# EAGLE design SmoothieDriverDualDC (EAGLE 6.2)
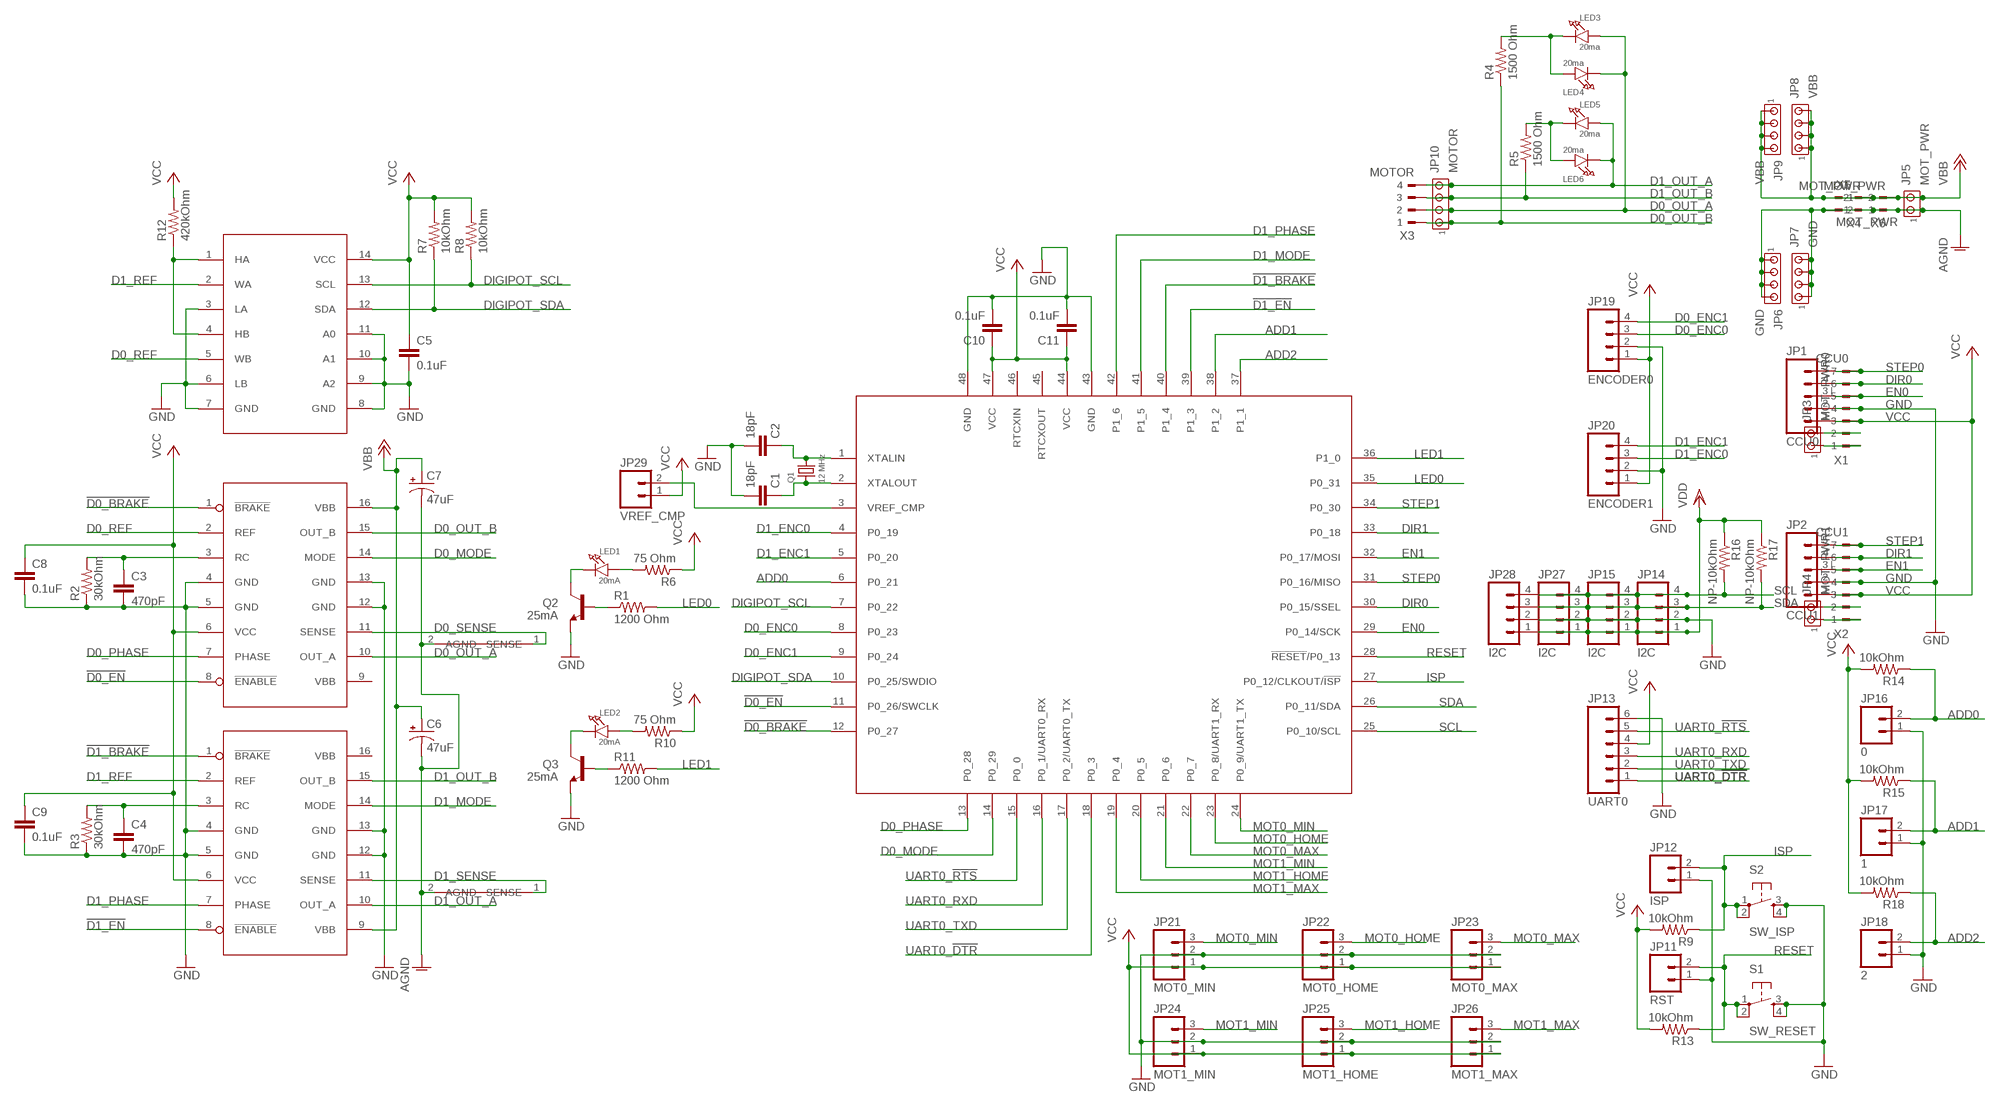
[diagram p0: schematic, sheet 1]

## Parts
C1  18pF  C-EUC0603  [C0603]
C2  18pF  C-EUC0603  [C0603]
C3  470pF  C-EUC0603  [C0603]
C4  470pF  C-EUC0603  [C0603]
C5  0.1uF  C-EUC0603  [C0603]
C6  47uF  CAP_POLD  [PANASONIC_D]
C7  47uF  CAP_POLD  [PANASONIC_D]
C8  0.1uF  C-EUC0603  [C0603]
C9  0.1uF  C-EUC0603  [C0603]
C10  0.1uF  C-EUC0603  [C0603]
C11  0.1uF  C-EUC0603  [C0603]
JP1  CCU0  M05PTH  [1X05]
JP2  CCU1  M05PTH  [1X05]
JP3  MOT_PWR0  MTA02-100  [10X02MTA]
JP4  MOT_PWR1  MTA02-100  [10X02MTA]
JP5  MOT_PWR  MTA02-100  [10X02MTA]
JP6  GND  MTA04-100  [10X04MTA]
JP7  GND  MTA04-100  [10X04MTA]
JP8  VBB  MTA04-100  [10X04MTA]
JP9  VBB  MTA04-100  [10X04MTA]
JP10  MOTOR  MTA04-100  [10X04MTA]
JP11  RST  M02PTH  [1X02]
JP12  ISP  M02PTH  [1X02]
JP13  UART0  M06SIP  [1X06]
JP14  I2C  M04PTH  [1X04]
JP15  I2C  M04PTH  [1X04]
JP16  0  M02PTH  [1X02]
JP17  1  M02PTH  [1X02]
JP18  2  M02PTH  [1X02]
JP19  ENCODER0  M04PTH  [1X04]
JP20  ENCODER1  M04PTH  [1X04]
JP21  MOT0_MIN  M03PTH  [1X03]
JP22  MOT0_HOME  M03PTH  [1X03]
JP23  MOT0_MAX  M03PTH  [1X03]
JP24  MOT1_MIN  M03PTH  [1X03]
JP25  MOT1_HOME  M03PTH  [1X03]
JP26  MOT1_MAX  M03PTH  [1X03]
JP27  I2C  M04PTH  [1X04]
JP28  I2C  M04PTH  [1X04]
JP29  VREF_CMP  M02PTH  [1X02]
LED1  20mA  LED0805  [CHIPLED_0805]
LED2  20mA  LED0805  [CHIPLED_0805]
LED3  20ma  LED0805  [CHIPLED_0805]
LED4  20ma  LED0805  [CHIPLED_0805]
LED5  20ma  LED0805  [CHIPLED_0805]
LED6  20ma  LED0805  [CHIPLED_0805]
MCU1  LPC1227  [LQFP48]
Q1  12 MHz  CRYSTALTHIN  [CRYSTAL_3.2X2.5]
Q2  25mA  TRANSISTOR_NPNSOT23  [SOT23]
Q3  25mA  TRANSISTOR_NPNSOT23  [SOT23]
R1  1200 Ohm  R-US_R0603  [R0603]
R2  30kOhm  R-US_R0603  [R0603]
R3  30kOhm  R-US_R0603  [R0603]
R4  1500 Ohm  R-US_R0603  [R0603]
R5  1500 Ohm  R-US_R0603  [R0603]
R6  75 Ohm  R-US_R0603  [R0603]
R7  10kOhm  R-US_R0603  [R0603]
R8  10kOhm  R-US_R0603  [R0603]
R9  10kOhm  R-US_R0603  [R0603]
R10  75 Ohm  R-US_R0603  [R0603]
R11  1200 Ohm  R-US_R0603  [R0603]
R12  420kOhm  R-US_R0603  [R0603]
R13  10kOhm  R-US_R0603  [R0603]
R14  10kOhm  R-US_R0603  [R0603]
R15  10kOhm  R-US_R0603  [R0603]
R16  NP-10kOhm  R-US_R0603  [R0603]
R17  NP-10kOhm  R-US_R0603  [R0603]
R18  10kOhm  R-US_R0603  [R0603]
S1  SW_RESET  TAC_SWITCHSMD  [TACTILE_SWITCH_SMD]
S2  SW_ISP  TAC_SWITCHSMD  [TACTILE_SWITCH_SMD]
U1  MAX5387-50kOhm  MAX5387  [TSSOP14]
U2  A4973  [SO16L]
U3  A4973  [SO16L]
U$1  CONNECTOR  [CONNECT]
U$2  CONNECTOR  [CONNECT]
X1  CCU0  180G-7  [180G-7]
X2  CCU1  180G-7  [180G-7]
X3  MOTOR  180G-4  [180G-4]
X4  MOT_PWR  180G-2  [180G-2]
X5  MOT_PWR  180G-2  [180G-2]
X6  MOT_PWR  180G-2  [180G-2]

## Nets
!D0_BRAKE: MCU1.12(P0_27) U2.1(!BRAKE)
!D0_EN: MCU1.11(P0_26/SWCLK) U2.8(!ENABLE)
!D1_BRAKE: MCU1.40(P1_4) U3.1(!BRAKE)
!D1_EN: MCU1.39(P1_3) U3.8(!ENABLE)
ADD0: JP16.2 MCU1.6(P0_21) R14.1
ADD1: JP17.2 MCU1.38(P1_2) R15.1
ADD2: JP18.2 MCU1.37(P1_1) R18.1
AGND: C6.- C7.- JP5.1 JP6.1 JP6.2 JP6.3 JP6.4 JP7.1 JP7.2 JP7.3 JP7.4 U$1.2(AGND) U$2.2(AGND) X4.1 X5.2 X6.1
D0_ENC0: JP19.3 MCU1.8(P0_23)
D0_ENC1: JP19.4 MCU1.9(P0_24)
D0_MODE: MCU1.14(P0_29) U2.14(MODE)
D0_OUT_A: JP10.2 LED3.A LED4.C U2.10(OUT_A) X3.2
D0_OUT_B: JP10.1 R4.1 U2.15(OUT_B) X3.1
D0_PHASE: MCU1.13(P0_28) U2.7(PHASE)
D0_REF: U1.5(WB) U2.2(REF)
D0_SENSE: U2.11(SENSE) U$2.1(SENSE)
D1_ENC0: JP20.3 MCU1.4(P0_19)
D1_ENC1: JP20.4 MCU1.5(P0_20)
D1_MODE: MCU1.41(P1_5) U3.14(MODE)
D1_OUT_A: JP10.4 LED5.A LED6.C U3.10(OUT_A) X3.4
D1_OUT_B: JP10.3 R5.1 U3.15(OUT_B) X3.3
D1_PHASE: MCU1.42(P1_6) U3.7(PHASE)
D1_REF: U1.2(WA) U3.2(REF)
D1_SENSE: U3.11(SENSE) U$1.1(SENSE)
DIGIPOT_SCL: MCU1.7(P0_22) R8.1 U1.13(SCL)
DIGIPOT_SDA: MCU1.10(P0_25/SWDIO) R7.1 U1.12(SDA)
DIR0: JP1.4 MCU1.30(P0_15/SSEL) X1.6
DIR1: JP2.4 MCU1.33(P0_18) X2.6
EN0: JP1.3 MCU1.29(P0_14/SCK) X1.5
EN1: JP2.3 MCU1.32(P0_17/MOSI) X2.5
GND: C1.2 C2.2 C3.2 C4.2 C5.2 C8.2 C9.2 C10.2 C11.2 JP1.2 JP2.2 JP11.1 JP12.1 JP13.6 JP14.2 JP15.2 JP16.1 JP17.1 JP18.1 JP19.2 JP20.2 JP21.2 JP22.2 JP23.2 JP24.2 JP25.2 JP26.2 JP27.2 JP28.2 MCU1.43(GND) MCU1.48(GND) Q2.2(E) Q3.2(E) R2.1 R3.1 S1.3 S1.4 S2.3 S2.4 U1.3(LA) U1.6(LB) U1.7(GND) U1.8(GND) U1.9(A2) U1.10(A1) U1.11(A0) U2.4(GND) U2.5(GND) U2.12(GND) U2.13(GND) U3.4(GND) U3.5(GND) U3.12(GND) U3.13(GND) X1.4 X2.4
ISP: JP12.2 MCU1.27(P0_12/CLKOUT/!ISP) R9.1 S2.1 S2.2
LED0: MCU1.35(P0_31) R1.2
LED1: MCU1.36(P1_0) R11.2
MOT0_HOME: JP22.3 MCU1.23(P0_8/UART1_RX)
MOT0_MAX: JP23.3 MCU1.22(P0_7)
MOT0_MIN: JP21.3 MCU1.24(P0_9/UART1_TX)
MOT1_HOME: JP25.3 MCU1.20(P0_5)
MOT1_MAX: JP26.3 MCU1.19(P0_4)
MOT1_MIN: JP24.3 MCU1.21(P0_6)
N$1: LED1.A R6.2
N$2: LED1.C Q2.3(C)
N$3: C3.1 R2.2 U2.3(RC)
N$4: C2.1 MCU1.1(XTALIN) Q1.2
N$5: C1.1 MCU1.2(XTALOUT) Q1.1
N$6: Q2.1(B) R1.1
N$7: Q3.1(B) R11.1
N$8: C4.1 R3.2 U3.3(RC)
N$9: LED2.A R10.2
N$10: LED2.C Q3.3(C)
N$11: R12.1 U1.1(HA) U1.4(HB)
N$12: LED5.C LED6.A R5.2
N$13: LED3.C LED4.A R4.2
N$14: JP4.2 X2.2
N$15: JP4.1 X2.1
N$16: JP3.2 X1.2
N$17: JP3.1 X1.1
N$18: JP29.2 MCU1.3(VREF_CMP)
RESET: JP11.2 MCU1.28(!RESET!/P0_13) R13.1 S1.1 S1.2
SCL: JP14.4 JP15.4 JP27.4 JP28.4 MCU1.25(P0_10/SCL) R16.2
SDA: JP14.3 JP15.3 JP27.3 JP28.3 MCU1.26(P0_11/SDA) R17.2
STEP0: JP1.5 MCU1.31(P0_16/MISO) X1.7
STEP1: JP2.5 MCU1.34(P0_30) X2.7
UART0_!DTR!: JP13.1 MCU1.18(P0_3)
UART0_!RTS!: JP13.5 MCU1.15(P0_0)
UART0_RXD: JP13.3 MCU1.16(P0_1/UART0_RX)
UART0_TXD: JP13.2 MCU1.17(P0_2/UART0_TX)
VBB: C6.+ C7.+ JP5.2 JP8.1 JP8.2 JP8.3 JP8.4 JP9.1 JP9.2 JP9.3 JP9.4 U2.16(VBB) U3.9(VBB) X4.2 X5.1 X6.2
VCC: C5.1 C8.1 C9.1 C10.1 C11.1 JP1.1 JP2.1 JP13.4 JP19.1 JP20.1 JP21.1 JP22.1 JP23.1 JP24.1 JP25.1 JP26.1 JP29.1 MCU1.44(VCC) MCU1.47(VCC) R6.1 R7.2 R8.2 R9.2 R10.1 R12.2 R13.2 R14.2 R15.2 R18.2 U1.14(VCC) U2.6(VCC) U3.6(VCC) X1.3 X2.3
VDD: JP14.1 JP15.1 JP27.1 JP28.1 R16.1 R17.1
Unconnected: MCU1.45(RTCXOUT) MCU1.46(RTCXIN) U2.9(VBB) U3.16(VBB)

## Library data of the parts
C1-C5 C8-C11 = rcl:C-EU: CAPACITOR, European symbol
C6 C7 = SparkFun:CAP_POL: Capacitor Polarized These are standard SMD and PTH capacitors. Normally 10uF, 47uF, and 100uF in electrolytic and tantalum varieties. Always verify the external diameter of the through hole cap, it varies with capacity, voltage, and manufacturer. The EIA devices should be standard.
JP1 JP2 = SparkFun:M05: Header 5 Standard 5-pin 0.1" header. Use with straight break away headers (SKU : PRT-00116), right angle break away headers (PRT-00553), swiss pins (PRT-00743), machine pins (PRT-00117), and female headers (PRT-00115). Molex polarized connector foot print use with SKU : PRT-08230 with associated crimp pins and housings.
JP3-JP5 = con-amp:MTA02-100: AMP connector
JP6-JP10 = con-amp:MTA04-100: AMP connector
JP11 JP12 JP16-JP18 JP29 = SparkFun:M02: Header 2 Standard 2-pin 0.1" header. Use with straight break away headers (SKU : PRT-00116), right angle break away headers (PRT-00553), swiss pins (PRT-00743), machine pins (PRT-00117), and female headers (PRT-00115). Molex polarized connector foot print use with SKU : PRT-08233 with associated crimp pins and housings.
JP13 = SparkFun:M06: Header 6 Standard 6-pin 0.1" header. Use with straight break away headers (SKU : PRT-00116), right angle break away headers (PRT-00553), swiss pins (PRT-00743), machine pins (PRT-00117), and female headers (PRT-00115). Molex polarized connector foot print use with SKU : PRT-08094 with associated crimp pins and housings. NOTES ON THE VARIANTS LOCK and LOCK_LONGPADS... This footprint was designed to help hold the alignment of a through-hole component (i.e. 6-pin header) while soldering it into place. You may notice that each hole has been shifted either up or down by 0.005 of an inch from it's more standard position (which is a perfectly straight line). This slight alteration caused the pins (the squares in the middle) to touch the edges of the holes. Because they are alternating, it causes a "brace" to hold the component in place. 0.005 has proven to be the perfect amount of "off-center" position when using our standard breakaway headers. Although looks a little odd when you look at the bare footprint, once you have a header in there, the alteration is very hard to notice. Also, if you push a header all the way into place, it is covered up entirely on the bottom side. This idea of altering the position of holes to aid alignment will be further integrated into the Sparkfun Library for other footprints. It can help hold any component with 3 or more connection pins.
JP14 JP15 JP19 JP20 JP27 JP28 = SparkFun:M04: Header 4 Standard 4-pin 0.1" header. Use with straight break away headers (SKU : PRT-00116), right angle break away headers (PRT-00553), swiss pins (PRT-00743), machine pins (PRT-00117), and female headers (PRT-00115). Molex polarized connector foot print use with SKU : PRT-08231 with associated crimp pins and housings. 1MM SMD Version SKU: PRT-10208
JP21-JP26 = SparkFun:M03: Header 3 Standard 3-pin 0.1" header. Use with straight break away headers (SKU : PRT-00116), right angle break away headers (PRT-00553), swiss pins (PRT-00743), machine pins (PRT-00117), and female headers (PRT-00115). Molex polarized connector foot print use with SKU : PRT-08232 with associated crimp pins and housings.
LED1-LED6 = microbuilder:LED: LED 0603 - 0603 Surface Mount Package 2mA: Green LED - Low Power (3.9mcd, 2ma, 1.7Vf) - Digikey: 475-2709-2-ND Orange LED - Low Power (9.8mcd, 2ma, 1.8Vf) - Digikey: 475-1194-2-ND Red LED - Low Power (5mcd, 2ma, 1.8Vf) - Digikey: 475-1195-2-ND Yellow LED - Low Power (7mcd, 2ma, 1.8Vf) - Digikey: 475-1196-2-ND 5mA: Blue LED - Low Power (17mcd, 5ma, 2.9Vf) - Digikey: LNJ937W8CRACT-ND 0805 - 0805 Surface Mount Package 2mA: Red LED (8.8mcd, 2mA, 1.8Vf, Clear) - Low Power [Digikey: 475-2510-1-ND] Green LED (5mcd, 2mA, 1.8Vf, Clear) - Low Power [Digikey: 475-2730-1-ND] Yellow LED (11.3mcd, 2mA, 1.8Vf, Clear) - Low Power [Digikey: 475-2555-1-ND] 20mA: Red LED (104mcd, 20mA, Diffused) - LS R976 [Digikey: 475-1278-6-ND] Red LED (12mcd, 20mA, 2.0Vf, Clear) - APT2012EC [Digikey: 754-1128-1-ND] Green LED (15mcd, 20mA, 2.2Vf, Clear) - APT2012GC [Digikey: 754-1131-1-ND] Orange LED (160mcd, 20mA, 2.1Vf, Clear) - APT2012SECK [Digikey: 754-1130-1-ND] 1206 - 1206 Surface Mount Package Green LED (26mcd, 20mA, Diffused) - LG N971 [Digikey: 475-1407-6-ND] Red LED (15mcd, 20mA, Diffused) - LH N974 [Digikey: 475-1416-6-ND]
MCU1 = logxen:LPC1227
Q1 = microbuilder:CRYSTAL: Crystals HC49UP - Surface Mount Crystal 4.0MHz 18pF +/-30ppm Surface Mount Crystal [Digikey: 535-9857-1-ND] 12.0 MHz Surface Mount Crystal [Digikey: 535-9869-6-ND] 25.0 MHz Surface Mount Crystal [Digikey: 535-9078-1-ND] 3.2 x 2.5mm - MEMs SMT Crystal 12.0 MHz 8pF 15ppm 3.2 x 2.5mm Crystal [Digikey: -10-70°C: 644-1047-1-ND -40-125°C: 644-1128-1-ND] 16.0 MHz 8pF 15ppm 3.2 x 2.5mm Crystal [Digikey: -10-70°C: 644-1049-1-ND -40-125°C: 644-1129-2-ND] 16.0 MHz 10pF 10ppm 3.2 x 2.5mm Crystal [Digikey: 644-1100-1-ND] 27.12 MHz 18pF 30ppm 3.2 x 2.5mm Crystal [Digikey: 887-1424-1-ND] 27.12MHz 10pF 10ppm 3.2 x 2.5mm Crystal [Digikey: 887-1329-1-ND] 4.9 x 1.8mm - MEMs SMT Crystal 32.768 KHz 12.5pF 20ppm 4.9 x 1.8mm Crystal [Digikey: SE2415CT-ND] Cylinder 32.768KHz Cylinder Crystal
Q2 Q3 = SparkFun:TRANSISTOR_NPN: Transistor NPN BJT configuration in SOT23 package. MMBT2222 is the common NPN we use. Double check BCE configuration again layout.
R1-R18 = rcl:R-US_: RESISTOR, American symbol
S1 S2 = SparkFun:TAC_SWITCH: Momentary Switch Button commonly used for reset or general input. Spark Fun Electronics SKU : COM-00097
U1 = logxen:MAX5387: Dual, 256-Tap, Volatile, Low-Voltage Linear Taper Digital Potentiometer
U2 U3 = logxen:A4973: Full-bridge PWM Motor Driver
U$1 U$2 = logxen:CONNECTOR
X1 X2 = con-weidmueller-sl35:180G-7: WEIDMUELLER CLAMP CONNECTOR; OC_FARNELL: unknown; OC_NEWARK: unknown
X3 = con-weidmueller-sl35:180G-4: WEIDMUELLER CLAMP CONNECTOR; OC_FARNELL: unknown; OC_NEWARK: unknown
X4-X6 = con-weidmueller-sl35:180G-2: WEIDMUELLER CLAMP CONNECTOR; OC_FARNELL: unknown; OC_NEWARK: unknown

## Board
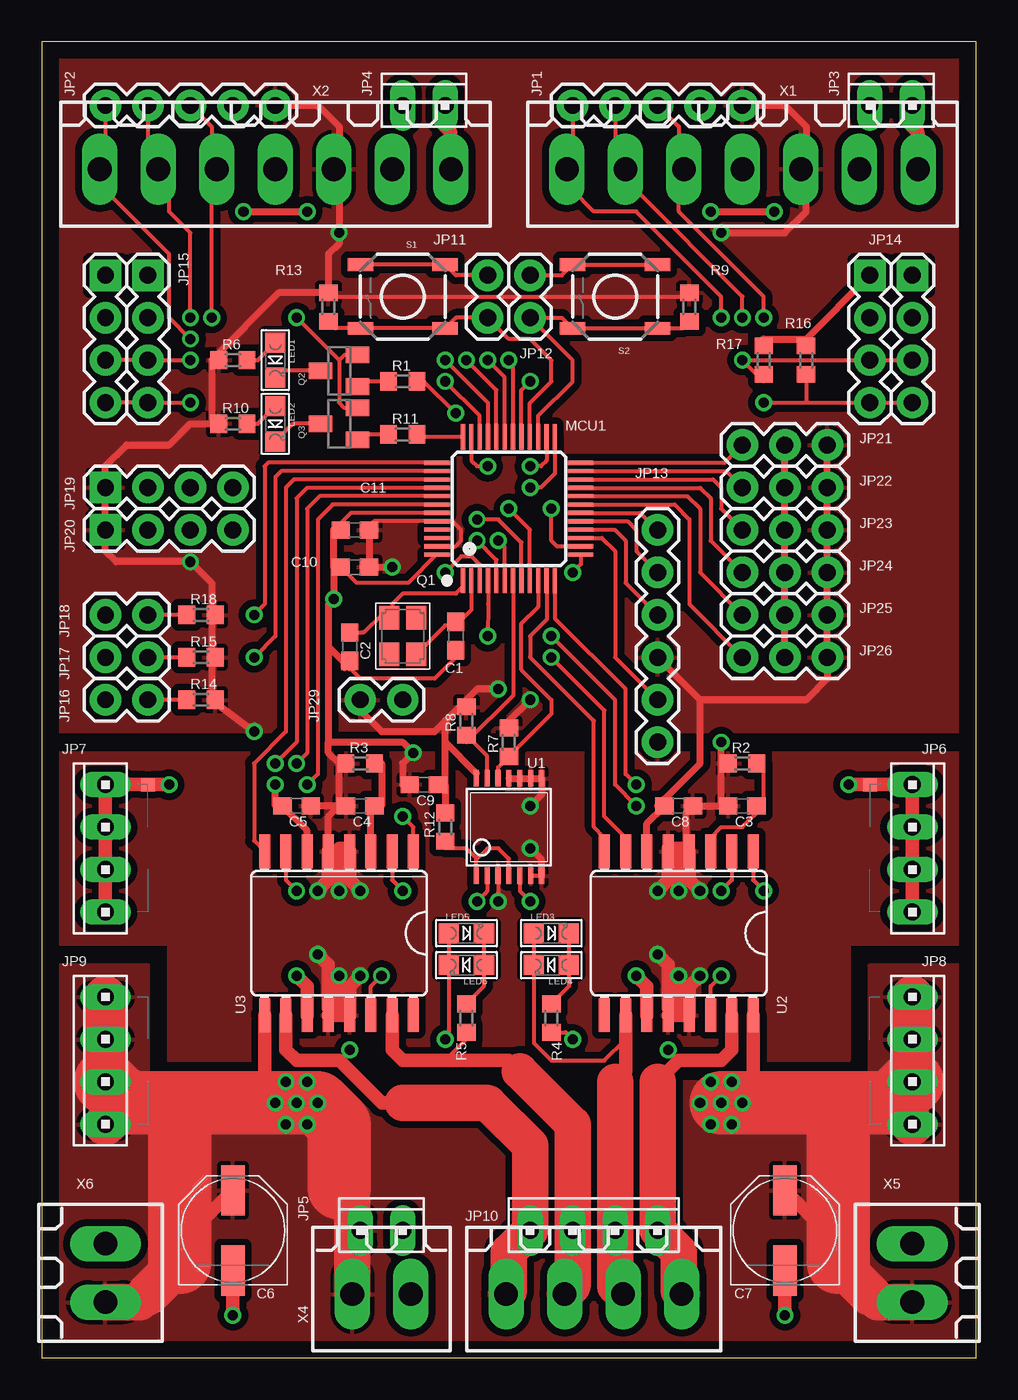
[diagram p1: board, top side]
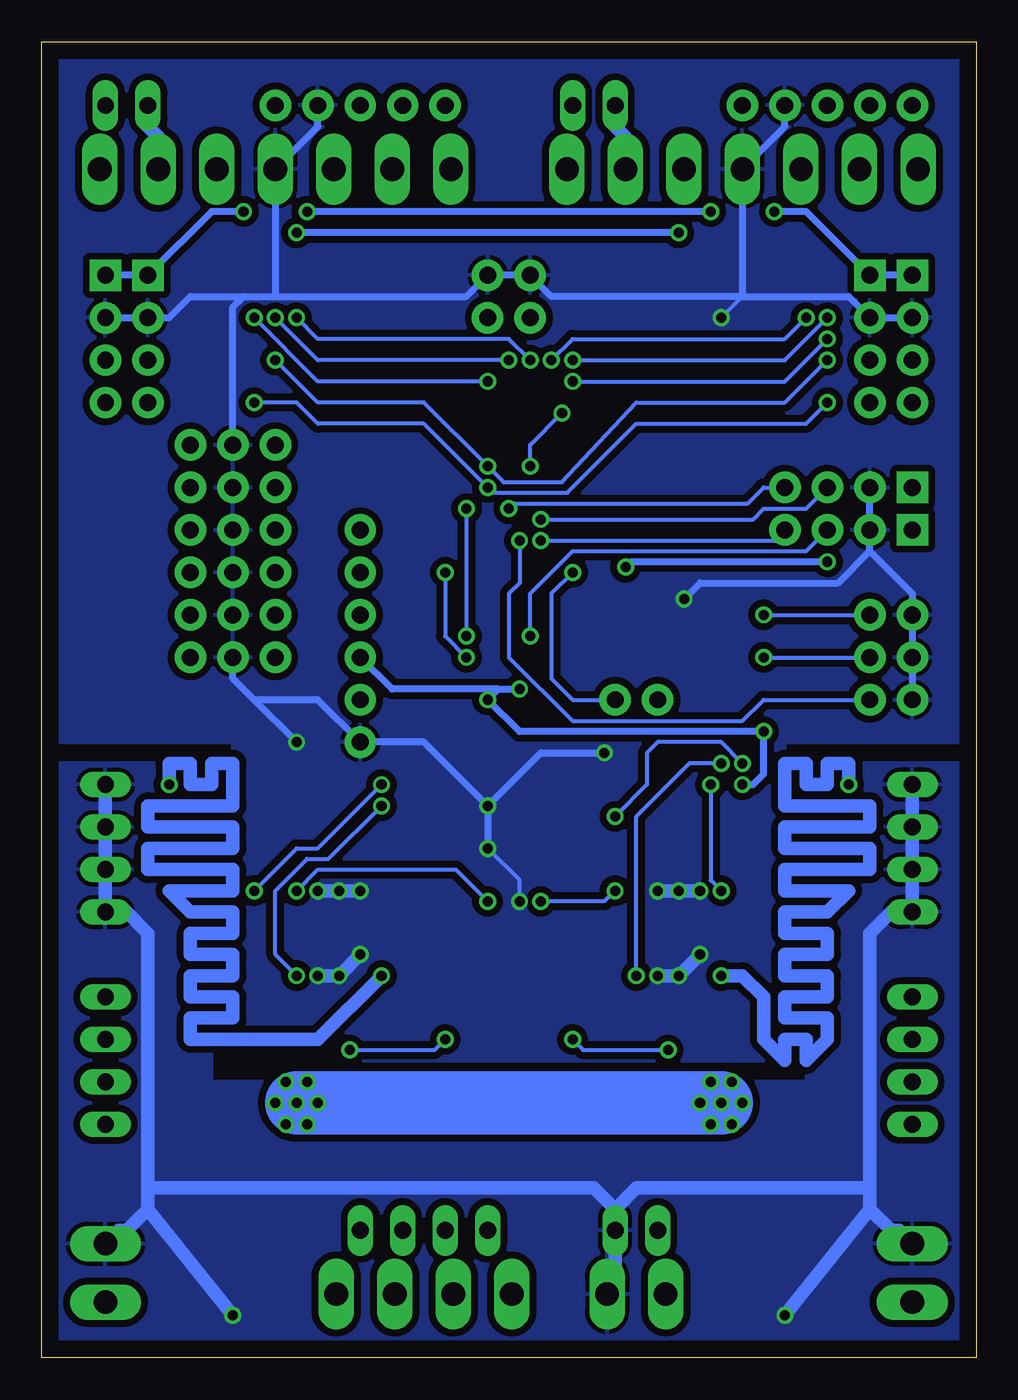
[diagram p2: board, bottom side, seen from below]

Size 55.88 x 78.74 mm. Coordinates in mm from the lower left corner, seen from the top.
Outline: 0,0 55.88,0 55.88,78.74 0,78.74 0,0
Copper layers (1*16): Top 0.07mm / dielectric 1.5mm / Bottom 0.07mm
Design rules: minimum track width 8mil, minimum drill 23mil, track to track 8mil, track to pad 8mil, pad to pad 8mil, via to via 8mil, smd to smd 8mil, copper to edge 40mil, drill to drill 8mil, minimum pad ring 10mil, minimum via ring 8mil, stop-mask expansion 4mil, vias tented up to drill 0mil, thermal gap 10mil

### Footprints (pad centres in the part's own frame; a part is rotated, then mirrored left to right if it is on the bottom)
C0603 = smd 1.1 x 1: 1 -0.85,0; 2 0.85,0
PANASONIC_D = smd 3 x 1.4: + 2.4,0; - -2.4,0
1X05 = drill 1.016 pad 1.88: 1 0,0; 2 2.54,0; 3 5.08,0; 4 7.62,0; 5 10.16,0
10X02MTA = drill 1.016 long: 1 1.27,0; 2 -1.27,0
10X04MTA = drill 1.016 long: 1 3.81,0; 2 1.27,0; 3 -1.27,0; 4 -3.81,0
1X02 = drill 1.016 pad 1.88: 1 0,0; 2 2.54,0
1X06 = drill 1.016 pad 1.88: 1 0,0; 2 2.54,0; 3 5.08,0; 4 7.62,0; 5 10.16,0; 6 12.7,0
1X04 = drill 1.016 pad 1.88 square: 1 0,0 | drill 1.016 pad 1.88: 2 2.54,0; 3 5.08,0; 4 7.62,0
1X03 = drill 1.016 pad 1.88: 1 0,0; 2 2.54,0; 3 5.08,0
CHIPLED_0805 = smd 1.2 x 1.2: A 0,-1.05; C 0,1.05
LQFP48 = smd 1.5 x 0.25: 1 -4.3,2.75; 2 -4.3,2.25; 3 -4.3,1.75; 4 -4.3,1.25; 5 -4.3,0.75; 6 -4.3,0.25; 7 -4.3,-0.25; 8 -4.3,-0.75; 9 -4.3,-1.25; 10 -4.3,-1.75; 11 -4.3,-2.25; 12 -4.3,-2.75; 25 4.3,-2.75; 26 4.3,-2.25; 27 4.3,-1.75; 28 4.3,-1.25; 29 4.3,-0.75; 30 4.3,-0.25; 31 4.3,0.25; 32 4.3,0.75; 33 4.3,1.25; 34 4.3,1.75; 35 4.3,2.25; 36 4.3,2.75 | smd 0.25 x 1.5: 13 -2.75,-4.3; 14 -2.25,-4.3; 15 -1.75,-4.3; 16 -1.25,-4.3; 17 -0.75,-4.3; 18 -0.25,-4.3; 19 0.25,-4.3; 20 0.75,-4.3; 21 1.25,-4.3; 22 1.75,-4.3; 23 2.25,-4.3; 24 2.75,-4.3; 37 2.75,4.3; 38 2.25,4.3; 39 1.75,4.3; 40 1.25,4.3; 41 0.75,4.3; 42 0.25,4.3; 43 -0.25,4.3; 44 -0.75,4.3; 45 -1.25,4.3; 46 -1.75,4.3; 47 -2.25,4.3; 48 -2.75,4.3
CRYSTAL_3.2X2.5 = smd 1.4 x 1.2: 1 -1.1,-0.8; 2 1.1,0.8; GND1 -1.1,0.8; GND2 1.1,-0.8
SOT23 = smd 1 x 1.4: 1 -0.95,-1.1; 2 0.95,-1.1; 3 0,1.1
R0603 = smd 1 x 1.1: 1 -0.85,0; 2 0.85,0
TACTILE_SWITCH_SMD = smd 1.524 x 0.762: 1 -2.54,1.905; 2 2.54,1.905; 3 -2.54,-1.905; 4 2.54,-1.905
TSSOP14 = smd 0.305 x 0.991: 1 -1.95,-2.918; 2 -1.3,-2.918; 3 -0.65,-2.918; 4 0,-2.918; 5 0.65,-2.918; 6 1.3,-2.918; 7 1.95,-2.918; 8 1.95,2.918; 9 1.3,2.918; 10 0.65,2.918; 11 0,2.918; 12 -0.65,2.918; 13 -1.3,2.918; 14 -1.95,2.918
SO16L = smd 0.66 x 2.032: 1 -4.445,-4.902; 2 -3.175,-4.902; 3 -1.905,-4.902; 4 -0.635,-4.902; 5 0.635,-4.902; 6 1.905,-4.902; 7 3.175,-4.902; 8 4.445,-4.902; 9 4.445,4.902; 10 3.175,4.902; 11 1.905,4.902; 12 0.635,4.902; 13 -0.635,4.902; 14 -1.905,4.902; 15 -3.175,4.902; 16 -4.445,4.902
CONNECT = smd 0.813 x 0.406: 1 0,0.203; 2 0,-0.203
180G-7 = drill 1.422 long: 1 -10.5,0; 2 -7,0; 3 -3.5,0; 4 0,0; 5 3.5,0; 6 7,0; 7 10.5,0
180G-4 = drill 1.422 long: 1 -5.25,0; 2 -1.75,0; 3 1.75,0; 4 5.25,0
180G-2 = drill 1.422 long: 1 -1.75,0; 2 1.75,0

### Placement (x,y rotation side)
C1  24.77,43.18 270 top
C2  18.41,42.55 270 top
C3  41.91,33.02 180 top
C4  19.05,33.02 180 top
C5  15.24,33.02 0 top
C6  11.43,7.62 90 top
C7  44.45,7.62 90 top
C8  38.1,33.02 0 top
C9  22.86,34.29 180 top
C10  18.73,47.31 180 top
C11  18.73,49.53 180 top
JP1  41.91,74.93 180 top
JP2  13.97,74.93 180 top
JP3  50.8,74.93 0 top
JP4  22.86,74.93 0 top
JP5  20.32,7.62 0 top
JP6  52.07,30.48 270 top
JP7  3.81,30.48 90 top
JP8  52.07,17.78 270 top
JP9  3.81,17.78 90 top
JP10  33.02,7.62 0 top
JP11  26.67,64.77 270 top
JP12  29.21,64.77 270 top
JP13  36.83,49.53 270 top
JP14  52.07,64.77 270 top
JP15  3.81,64.77 270 top
JP16  3.81,39.37 0 top
JP17  3.81,41.91 0 top
JP18  3.81,44.45 0 top
JP19  3.81,52.07 0 top
JP20  3.81,49.53 0 top
JP21  46.99,54.61 180 top
JP22  46.99,52.07 180 top
JP23  46.99,49.53 180 top
JP24  46.99,46.99 180 top
JP25  46.99,44.45 180 top
JP26  46.99,41.91 180 top
JP27  6.35,64.77 270 top
JP28  49.53,64.77 270 top
JP29  19.05,39.37 0 top
LED1  13.97,59.69 180 top
LED2  13.97,55.88 180 top
LED3  30.48,25.4 270 top
LED4  30.48,23.5 90 top
LED5  25.4,25.4 270 top
LED6  25.4,23.5 90 top
MCU1  27.94,50.8 90 top
Q1  21.59,43.18 90 top
Q2  17.78,59.05 90 top
Q3  17.78,55.88 90 top
R1  21.59,58.42 0 top
R2  41.91,35.56 0 top
R3  19.05,35.56 0 top
R4  30.48,20.32 90 top
R5  25.4,20.32 90 top
R6  11.43,59.69 0 top
R7  27.94,36.83 90 top
R8  25.4,38.1 90 top
R9  38.73,62.87 90 top
R10  11.43,55.88 0 top
R11  21.59,55.24 0 top
R12  24.13,31.75 90 top
R13  17.14,62.87 90 top
R14  9.53,39.37 0 top
R15  9.53,41.91 0 top
R16  45.72,59.69 270 top
R17  43.18,59.69 270 top
R18  9.53,44.45 0 top
S1  21.59,63.5 180 top
S2  34.29,63.5 180 top
U1  27.94,31.75 0 top
U2  38.1,25.4 180 top
U3  17.78,25.4 180 top
U$1  6.35,34.29 270 top
U$2  49.53,34.29 90 top
X1  41.91,71.12 180 top
X2  13.97,71.12 180 top
X3  33.02,3.81 180 top
X4  20.32,3.81 180 top
X5  52.07,5.08 90 top
X6  3.81,5.08 270 top

### Tracks (layer width: path | path; a pad name or v marks a point on that pad's centre or on a via)
!D0_BRAKE  (via drill 0.6)
  Top 0.254: U2.1 42.55,28.57 v43.18,27.94 | v35.56,34.29 34.92,34.92 34.92,40.01 30.69,44.24 MCU1.12
  Bottom 0.254: v43.18,27.94 40.64,30.48 39.37,30.48 v35.56,34.29
!D0_EN
  Top 0.254: U2.8 33.66,31.11 33.02,31.75 33.02,38.1 29.19,41.93 29.21,41.95 29.21,43.18 30.19,44.16 MCU1.11
!D1_BRAKE  (via drill 0.6)
  Top 0.254: U3.1 22.23,31.75 v21.59,32.38 | MCU1.40 15.86,52.05 15.24,51.44 15.24,36.83 v13.97,35.56
  Bottom 0.254: v13.97,35.56 15.24,36.83 19.05,36.83 19.68,36.2 19.68,34.29 v21.59,32.38
!D1_EN
  Top 0.254: MCU1.39 15.09,52.55 14.61,52.07 14.61,37.47 12.7,35.56 12.7,30.94 U3.8
ADD0  (via drill 0.6)
  Top 0.254: R14.1 JP16.2 | MCU1.6 27.69,48.51 v27.3,48.9
  Bottom 0.254: JP16.2 12.7,39.37 13.97,38.1 24.13,38.1 27.94,41.91 27.94,45.72 27.3,46.35 v27.3,48.9
ADD1  (via drill 0.6)
  Top 0.254: R15.1 JP17.2 | MCU1.38 14.31,53.05 13.97,52.7 13.97,43.18 v12.7,41.91
  Bottom 0.254: v12.7,41.91 JP17.2
ADD2  (via drill 0.6)
  Top 0.254: R18.1 JP18.2 | MCU1.37 13.54,53.55 13.34,53.34 13.34,45.09 v12.7,44.45
  Bottom 0.254: v12.7,44.45 JP18.2
AGND  (via drill 0.6)
  Top 0.813: C6.- v11.43,2.54 | C7.- v44.45,2.54 | JP6.1 JP6.2 JP6.3 JP6.4 U$2.2 | JP7.4 JP7.3 JP7.2 JP7.1 U$1.2
  Bottom 0.813: 6.35,10.16 6.35,25.4 5.08,26.67 JP7.4 JP7.3 JP7.2 JP7.1 | 6.35,10.16 6.35,8.89 | 49.53,10.16 49.53,25.4 50.8,26.67 JP6.1 JP6.2 JP6.3 JP6.4 | 49.53,10.16 49.53,8.89 | v11.43,2.54 6.35,8.89 | X4.1 21.59,4.29 JP5.1 21.59,8.89 | v44.45,2.54 49.53,8.89 | 21.59,8.89 20.32,10.16 6.35,10.16 | 21.59,8.89 22.86,10.16 49.53,10.16 | 6.35,8.89 5.08,7.62 4.6,7.62 X6.1 | 49.53,8.89 50.8,7.62 51.28,7.62 X5.2
  pour Bottom (isolate 0.406): -1.27,35.56 10.16,35.56 10.16,16.51 45.72,16.51 45.72,35.56 57.15,35.56 57.15,-1.27 -1.27,-1.27
D0_ENC0  (via drill 0.6)
  Top 0.254: MCU1.8 28.69,48.78 27.3,50.16 v26.04,50.16
  Bottom 0.254: v26.04,50.16 13.34,50.16 12.7,50.8 10.16,50.8 JP19.3
D0_ENC1  (via drill 0.6)
  Top 0.254: MCU1.9 29.19,49.55 v27.94,50.8
  Bottom 0.254: v27.94,50.8 27.62,51.12 13.65,51.12 12.7,52.07 JP19.4
D0_MODE  (via drill 0.6)
  Top 0.254: U2.14 40.01,22.23 v40.64,22.86 | v35.56,33.02 34.29,34.29 34.29,39.37 v30.48,43.18 | MCU1.14 30.82,48.55 30.48,48.9 v30.48,50.8
  Bottom 0.254: v40.64,22.86 41.91,24.13 41.91,27.94 40.01,29.84 38.73,29.84 v35.56,33.02 | v30.48,50.8 v30.48,43.18
D0_OUT_A
  Top 0.254: LED3.A LED4.C 29.43,18.83 30.48,17.78 33.66,17.78 34.92,19.05
  Top 0.813: U2.10 34.92,19.05 34.92,17.14 34.29,16.51
  Top 2.184: 34.29,16.51 JP10.2 34.29,4.39 arc45 34.36,4.22 X3.2
D0_OUT_B  (via drill 0.6)
  Top 0.254: R4.1 31.33,19.47 v31.75,19.05 | 38.1,17.78 v37.47,18.41
  Top 0.813: U2.15 41.27,18.41 40.64,17.78 38.1,17.78 36.83,16.51
  Top 2.184: 36.83,16.51 JP10.1 38.1,6.35 38.1,4.08 arc45 38.17,3.91 X3.1
  Bottom 0.254: v31.75,19.05 32.38,18.41 v37.47,18.41
D0_PHASE  (via drill 0.6)
  Top 0.254: v30.48,41.91 33.66,38.73 33.66,32.38 34.92,31.11 U2.7 | MCU1.13 32.24,47.48 v31.75,46.99
  Bottom 0.254: v31.75,46.99 31.75,43.18 v30.48,41.91
D0_REF  (via drill 0.6)
  Top 0.254: U1.5 28.59,27.93 v29.21,27.3 | U2.2 41.27,28.57 v40.64,27.94
  Bottom 0.254: v40.64,27.94 39.37,29.21 31.11,29.21 v29.21,27.3
D0_SENSE  (via drill 0.6)
  Top 0.813: U2.11 36.2,22.23 v35.56,22.86 | v48.26,34.29 U$2.1
  Bottom 0.813: v35.56,22.86 39.37,19.05 46.99,19.05 46.99,20.32 44.45,20.32 44.45,21.59 46.99,21.59 46.99,22.86 44.45,22.86 44.45,24.13 46.99,24.13 46.99,25.4 44.45,25.4 44.45,26.67 46.99,26.67 48.26,27.94 44.45,27.94 44.45,29.21 49.53,29.21 49.53,30.48 44.45,30.48 44.45,31.75 49.53,31.75 49.53,33.02 44.45,33.02 44.45,35.56 45.72,35.56 45.72,34.29 46.99,34.29 46.99,35.56 48.26,35.56 v48.26,34.29
D1_ENC0  (via drill 0.6)
  Top 0.254: MCU1.4 26.69,45.1 v26.67,43.18
  Bottom 0.254: v26.67,43.18 26.67,45.72 24.13,48.26 10.16,48.26 JP20.3
D1_ENC1  (via drill 0.6)
  Top 0.254: MCU1.5 27.19,47.74 v26.04,48.9
  Bottom 0.254: v26.04,48.9 12.06,48.9 JP20.4
D1_MODE  (via drill 0.6)
  Top 0.254: U3.14 19.68,22.23 v20.32,22.86 | MCU1.41 16.62,51.55 15.88,50.8 15.88,36.2 v15.24,35.56
  Bottom 0.254: v20.32,22.86 20.32,32.38 17.14,35.56 v15.24,35.56
D1_OUT_A  (via drill 0.6)
  Top 0.254: LED5.A LED6.C 24.35,19.27 v24.13,19.05 | v18.41,18.41 17.78,17.78
  Top 0.813: U3.10 14.61,18.41 15.24,17.78 17.78,17.78 20.32,15.24 21.59,15.24
  Top 2.184: 21.59,15.24 26.57,15.24 arc-45 26.74,15.17 29.21,12.7 JP10.4 27.94,6.35 27.94,4.08 arc-45 27.87,3.91 X3.4
  Bottom 0.254: v24.13,19.05 23.5,18.41 v18.41,18.41
D1_OUT_B
  Top 0.254: R5.1 25.4,19.05 24.13,17.78
  Top 0.813: U3.15 20.95,18.41 21.59,17.78 24.13,17.78 27.94,17.78 28.57,17.14
  Top 2.184: 28.57,17.14 31.75,13.97 JP10.3 31.75,4.39 arc-45 31.68,4.22 X3.3
D1_PHASE  (via drill 0.6)
  Top 0.254: MCU1.42 17.39,51.05 16.51,50.16 16.51,34.92 v15.88,34.29 | U3.7 14.61,28.57 v15.24,27.94
  Bottom 0.254: v15.88,34.29 15.88,28.57 v15.24,27.94
D1_REF  (via drill 0.6)
  Top 0.254: U3.2 20.95,28.57 v21.59,27.94 | U1.2 26.64,27.91 v26.04,27.3
  Bottom 0.254: v21.59,27.94 22.23,27.3 v26.04,27.3
D1_SENSE  (via drill 0.6)
  Top 0.813: U3.11 15.88,22.23 v15.24,22.86 | v7.62,34.29 U$1.1
  Bottom 0.813: v15.24,22.86 13.97,22.86 12.7,21.59 12.7,19.05 11.43,17.78 11.43,19.05 10.16,19.05 10.16,17.78 8.89,19.05 8.89,20.32 11.43,20.32 11.43,21.59 8.89,21.59 8.89,22.86 11.43,22.86 11.43,24.13 8.89,24.13 8.89,25.4 11.43,25.4 11.43,26.67 8.89,26.67 7.62,27.94 11.43,27.94 11.43,29.21 6.35,29.21 6.35,30.48 11.43,30.48 11.43,31.75 6.35,31.75 6.35,33.02 11.43,33.02 11.43,35.56 10.16,35.56 10.16,34.29 8.89,34.29 8.89,35.56 7.62,35.56 v7.62,34.29
DIGIPOT_SCL
  Top 0.254: U1.13 26.64,36.01 R8.1 25.4,36.83 28.19,39.62 MCU1.7
DIGIPOT_SDA
  Top 0.254: U1.12 27.29,35.33 R7.1 30.48,38.52 30.48,39.37 28.69,41.16 28.69,43.93 29.69,44.93 MCU1.10
DIR0  (via drill 0.6)
  Top 0.254: v41.91,62.23 41.91,63.5 35.56,69.85 35.56,70.47 X1.6 34.36,71.67 arc-45 34.29,71.84 JP1.4 | MCU1.30 28.19,59.44 v27.94,59.69
  Bottom 0.254: v27.94,59.69 39.37,59.69 v41.91,62.23
DIR1  (via drill 0.6)
  Top 0.254: MCU1.33 26.69,57.13 v24.13,59.69 | v8.89,62.23 8.89,67.31 7.62,68.58 7.62,70.47 X2.6 6.42,71.67 arc-45 6.35,71.84 JP2.4
  Bottom 0.254: v24.13,59.69 11.43,59.69 v8.89,62.23
EN0  (via drill 0.6)
  Top 0.254: v43.18,62.23 43.18,63.5 38.1,68.58 38.1,70.81 X1.5 38.17,71.36 arc-45 38.1,71.53 38.1,73.66 JP1.3 | MCU1.29 28.69,57.9 v29.21,58.42
  Bottom 0.254: v29.21,58.42 39.37,58.42 v43.18,62.23
EN1  (via drill 0.6)
  Top 0.254: MCU1.32 27.19,57.9 v25.4,59.69 | v10.16,62.23 10.16,70.81 X2.5 10.23,71.36 arc-45 10.16,71.53 10.16,73.66 JP2.3
  Bottom 0.254: v25.4,59.69 24.13,60.96 11.43,60.96 v10.16,62.23
GND  (via drill 0.6)
  Top 0.254: S2.3 S2.4 31.11,64.77 JP12.1 | S1.4 S1.3 24.77,64.77 JP11.1 | Q2.2 18.09,60.01 17.78,59.69 | 17.78,59.69 17.78,57.15 18.1,56.83 Q3.2 | 17.78,59.69 v15.24,62.23 | U1.7 U1.6 | U1.3 27.29,27.32 v27.3,27.3 | MCU1.43 18.48,50.55 17.46,49.53 | C1.2 24.77,41.91 23.5,40.64 19.16,40.64 arc-45 18.98,40.71 18.41,41.27 | MCU1.48 23.6,48.05 21.91,46.35 18.84,46.35 C10.2 | C2.2 arc-45 18.34,41.52 18.1,41.27
  Top 0.406: JP26.2 JP25.2 JP24.2 JP23.2 JP22.2 JP21.2 | U1.11 U1.10 U1.9 U1.8 29.89,33.7 v29.21,33.02 | U1.7 29.89,29.8 v29.21,30.48 | 38.56,30.48 38.56,32.63 C8.2 40.64,33.02 | C3.2 40.64,33.02 | 40.64,33.02 40.64,35.56 | R2.1 40.64,35.56 | 40.64,35.56 v40.64,36.83 | C9.2 21.59,34.29 21.59,35.56 v22.23,36.2 21.59,36.83 17.14,36.83 | U3.5 17.14,32.38 17.78,33.02 | 17.78,33.02 C5.2 | C4.2 17.78,33.02 | 17.78,33.02 17.78,35.56 | R3.1 17.78,35.56 | 17.78,35.56 17.14,36.2 17.14,36.83 | C10.2 17.46,47.31 | 17.46,47.31 v17.46,45.4 17.14,45.09 17.14,42.55 | 17.46,47.31 17.46,49.53 C11.2 | 18.41,41.27 C2.2 | 17.14,42.55 17.14,36.83 | 18.1,41.27 18.1,41.49 arc45 18.02,41.67 17.14,42.55
  Top 0.813: U3.12 U3.13 18.41,20.95 | U2.12 U2.13 38.73,20.95 | v39.37,22.86 38.73,22.23 38.73,20.95 | 38.73,20.95 38.1,20.95 | v38.1,22.86 38.1,20.95 | 38.1,20.95 37.47,20.95 37.47,23.5 v36.83,24.13 | v19.05,22.86 18.41,22.23 18.41,20.95 | 18.41,20.95 17.78,20.95 | v17.78,22.86 17.78,20.95 | 17.78,20.95 17.14,20.95 17.14,23.5 v16.51,24.13 | U3.5 17.14,29.84 | v16.51,27.94 17.14,28.57 17.14,29.84 | 17.14,29.84 17.78,29.84 | 17.78,29.84 v17.78,27.94 | 17.78,29.84 17.78,30.48 18.24,30.48 U3.4 18.41,28.57 v19.05,27.94 | v36.83,27.94 37.47,28.57 U2.5 37.47,30.48 38.1,30.48 | v38.1,27.94 38.1,30.48 | 38.1,30.48 38.56,30.48 U2.4 38.73,28.57 v39.37,27.94
  Bottom 0.254: v15.24,62.23 13.97,63.5 | v27.3,27.3 27.3,28.57 v29.21,30.48
  Bottom 0.406: 13.97,63.5 25.4,63.5 JP11.1 JP12.1 30.48,63.5 41.91,63.5 | 13.97,63.5 X2.4 11.43,73.66 JP2.2 | 41.91,63.5 X1.4 39.37,73.66 JP1.2 | 13.97,63.5 7.62,63.5 JP27.2 JP15.2 | JP14.2 48.26,62.23 46.99,63.5 43.81,63.5 | 43.81,63.5 41.91,63.5 | JP19.2 JP20.2 6.35,48.26 | JP16.1 JP17.1 JP18.1 3.81,45.72 6.35,48.26 | JP21.2 44.45,62.87 43.81,63.5 | 43.18,39.37 39.37,39.37 JP13.6 33.02,36.83 v29.21,33.02 | 43.18,39.37 44.45,40.64 JP26.2 | v29.21,33.02 v29.21,30.48 | v40.64,36.83 43.18,39.37 | v29.21,33.02 26.04,36.2 v22.23,36.2 | v17.46,45.4 16.51,46.35 8.26,46.35 6.35,48.26
  Bottom 0.813: v19.05,22.86 v17.78,22.86 v16.51,24.13 | v39.37,22.86 v38.1,22.86 v36.83,24.13 | v16.51,27.94 v17.78,27.94 v19.05,27.94 | v36.83,27.94 v38.1,27.94 v39.37,27.94
  pour Top (isolate 0.406): -1.27,36.2 57.15,36.2 57.15,24.77 48.26,24.77 48.26,17.78 7.62,17.78 7.62,24.77 -1.27,24.77
  pour Bottom (isolate 0.406): -1.27,80.01 57.15,80.01 57.15,36.83 44.45,36.83 44.45,17.78 11.43,17.78 11.43,36.83 -1.27,36.83
ISP
  Top 0.254: R9.1 38.31,61.59 S2.1 S2.2 31.11,62.23 JP12.2 31.75,59.69 31.75,58.42 29.69,56.36 MCU1.27
LED0  (via drill 0.6)
  Top 0.254: MCU1.35 25.69,53.69 26.04,53.34 v26.67,53.34 | v24.77,56.52 22.86,58.42 R1.2
  Bottom 0.254: v26.67,53.34 26.67,54.61 v24.77,56.52
LED1
  Top 0.254: MCU1.36 22.59,55.1 R11.2
MOT0_HOME
  Top 0.254: MCU1.23 40.93,53.05 JP22.3
MOT0_MAX
  Top 0.254: MCU1.22 40.16,52.55 40.64,52.07 40.64,50.8 JP23.3
MOT0_MIN
  Top 0.254: MCU1.24 40.85,53.55 JP21.3
MOT1_HOME
  Top 0.254: MCU1.20 38.62,51.55 39.37,50.8 39.37,46.99 JP25.3
MOT1_MAX
  Top 0.254: MCU1.19 37.85,51.05 38.73,50.16 38.73,45.09 JP26.3
MOT1_MIN
  Top 0.254: MCU1.21 39.39,52.05 40.01,51.44 40.01,48.9 JP24.3
N$1
  Top 0.254: R6.2 12.92,59.69 LED1.A
N$2
  Top 0.254: Q2.3 14.38,59.05 LED1.C
N$3
  Top 0.254: U2.3 40.01,31.11 40.64,31.75 41.91,31.75 43.18,33.02 | C3.1 43.18,33.02 | 43.18,33.02 43.18,35.56 R2.2
N$4
  Top 0.254: MCU1.1 25.19,46.15 24.77,45.72 21.59,45.72 20.95,45.09 20.95,44.45 Q1.2 20.69,44.38 arc45 20.52,44.45 20.32,44.45 19.34,43.47 arc-45 19.16,43.4 C2.1
N$5
  Top 0.254: MCU1.2 25.69,44.74 24.77,43.81 | C1.1 24.77,43.81 | 22.86,41.91 22.56,41.91 Q1.1 24.12,43.81 24.77,43.81
N$6
  Top 0.254: R1.1 19.2,58.42 Q2.1
N$7
  Top 0.254: R11.1 19.2,55.24 Q3.1
N$8
  Top 0.406: U3.3 19.68,32.8 C4.1 20.32,33.02 20.32,35.56 R3.2
N$9
  Top 0.254: R10.2 12.92,55.88 LED2.A
N$10
  Top 0.254: Q3.3 15.02,55.88 LED2.C
N$11
  Top 0.254: U1.4 27.94,29.84 27.3,30.48 26.67,30.48 25.99,29.8 U1.1 25.99,29.89 25.4,30.48 24.13,30.48 R12.1
N$12
  Top 0.254: LED5.C LED6.A 26.45,22.22 R5.2
N$13
  Top 0.254: LED3.C LED4.A 31.53,22.22 R4.2
N$14
  Bottom 0.813: X2.2 20.97,72.94 arc-45 21.04,73.11 21.59,73.66 JP4.2
N$15
  Top 0.813: X2.1 24.47,73.22 arc45 24.4,73.39 24.13,73.66 JP4.1
N$16
  Bottom 0.813: X1.2 48.91,72.94 arc-45 48.98,73.11 49.53,73.66 JP3.2
N$17
  Top 0.813: X1.1 52.41,73.22 arc45 52.34,73.39 52.07,73.66 JP3.1
N$18  (via drill 0.6)
  Top 0.254: MCU1.3 26.19,47.47 25.72,47.94 25.08,47.94 v24.13,46.99
  Bottom 0.254: v24.13,46.99 25.4,45.72 25.4,40.64 24.13,39.37 JP29.2
RESET
  Top 0.254: R13.1 17.57,61.59 S1.2 S1.1 24.77,62.23 JP11.2 27.94,60.96 29.21,60.96 30.48,59.69 30.48,58.42 29.19,57.13 MCU1.28
SCL  (via drill 0.6)
  Top 0.254: JP15.4 JP27.4 v8.89,57.15 | v43.18,57.15 45.72,57.15 | 45.72,57.15 JP28.4 JP14.4 | MCU1.25 30.69,52.91 29.84,52.07 v29.21,52.07 | R16.2 45.72,57.15
  Bottom 0.254: v8.89,57.15 10.16,55.88 20.32,55.88 24.45,51.75 28.89,51.75 v29.21,52.07 33.02,55.88 39.37,55.88 40.64,57.15 v43.18,57.15
SDA  (via drill 0.6)
  Top 0.254: JP15.3 JP27.3 v8.89,59.69 | MCU1.26 30.19,53.69 29.84,53.34 v29.21,53.34 | JP14.3 JP28.3 v41.91,59.69 43.18,58.42 R17.2
  Bottom 0.254: v8.89,59.69 11.43,57.15 20.32,57.15 24.77,52.39 28.26,52.39 v29.21,53.34 33.02,57.15 39.37,57.15 v41.91,59.69
STEP0  (via drill 0.6)
  Top 0.254: v40.64,62.23 40.64,63.5 35.56,68.58 33.02,68.58 31.75,69.85 31.75,70.78 X1.7 31.68,71.39 arc45 31.75,71.56 JP1.5 | MCU1.31 27.69,58.67 v26.67,59.69
  Bottom 0.254: v26.67,59.69 27.94,60.96 39.37,60.96 v40.64,62.23
STEP1  (via drill 0.6)
  Top 0.254: MCU1.34 26.19,56.36 v24.13,58.42 | v8.89,60.96 7.62,62.23 7.62,66.04 3.81,69.85 3.81,70.78 X2.7 3.74,71.39 arc45 3.81,71.56 JP2.5
  Bottom 0.254: v24.13,58.42 11.43,58.42 v8.89,60.96
UART0_!DTR!
  Top 0.254: MCU1.18 35.81,50.55 JP13.1
UART0_!RTS!
  Top 0.254: MCU1.15 33.5,49.05 34.29,48.26 34.29,41.91 JP13.5
UART0_RXD
  Top 0.254: MCU1.16 34.27,49.55 34.92,48.9 34.92,46.35 JP13.3
UART0_TXD
  Top 0.254: MCU1.17 35.04,50.05 35.56,49.53 35.56,48.26 JP13.2
VBB  (via drill 0.6)
  Top 0.813: U3.9 13.34,15.88 v13.97,15.24 | U2.16 42.55,15.88 v41.91,15.24 | 8.26,5.71 8.26,6.84 C6.+ | 47.62,5.71 47.62,6.84 C7.+ | v40.01,16.51 v41.27,16.51 41.27,15.88 v41.91,15.24 | v40.01,13.97 v41.27,13.97 41.27,14.61 v41.91,15.24 | v14.61,13.97 v15.88,13.97 15.88,14.61 v16.51,15.24 15.88,15.88 v15.88,16.51 v14.61,16.51
  Top 1.27: 18.57,9.37 18.57,8.1 JP5.2
  Top 2.184: X6.2 5.87,3.33 6.35,3.81 | 49.53,3.81 50.01,3.33 X5.1 | X4.2 18.57,9.37 17.78,10.16
  Top 2.54: 8.26,5.71 6.35,3.81 | 47.62,5.71 49.53,3.81 | JP8.4 JP8.3 JP8.2 | 50.8,15.24 JP8.1 | JP9.1 JP9.2 JP9.3 | JP9.4 5.08,15.24
  Top 3.81: 7.62,15.24 v13.97,15.24 v15.24,15.24 v16.51,15.24 17.78,13.97 17.78,10.16 | 7.62,15.24 5.08,15.24 JP9.3 | v40.64,15.24 v41.91,15.24 48.26,15.24 | 48.26,15.24 50.8,15.24 JP8.2 | 8.26,5.71 8.26,14.61 7.62,15.24 | 47.62,5.71 47.62,14.61 48.26,15.24
  Bottom 3.81: v15.24,15.24 v16.51,15.24 v39.37,15.24 v40.64,15.24
  pour Top (isolate 0.406): -1.27,23.5 6.35,23.5 6.35,16.51 49.53,16.51 49.53,23.5 57.15,23.5 57.15,-1.27 -1.27,-1.27
VCC  (via drill 0.6)
  Top 0.254: R9.2 38.52,63.5 17.36,63.5 R13.2 | U1.14 25.99,34.97 | C11.1 19.37,49.53 19.89,50.05 MCU1.44 24.56,50.05 25.08,49.53 25.08,48.9 24.74,48.55 MCU1.47
  Top 0.406: v40.64,67.31 44.45,67.31 45.72,68.58 45.72,70.7 arc45 45.65,70.88 X1.3 45.65,71.36 arc45 45.72,71.53 45.72,73.66 44.52,74.86 arc45 44.34,74.93 JP1.1 | 10.16,59.69 14.19,63.72 R13.2 17.14,66.04 17.78,66.67 v17.78,67.31 17.78,70.81 X2.3 17.71,71.36 arc45 17.78,71.53 17.78,73.66 16.58,74.86 arc45 16.41,74.93 JP2.1 | R6.1 10.16,59.69 | 10.16,59.69 10.16,55.88 | 10.16,55.88 8.89,55.88 7.62,54.61 5.08,54.61 3.81,53.34 JP19.1 JP20.1 3.81,48.26 4.45,47.62 v8.89,47.62 10.16,46.35 10.16,44.45 | 10.16,55.88 R10.1 | JP21.1 JP22.1 JP23.1 JP24.1 JP25.1 JP26.1 46.99,40.64 45.72,39.37 39.37,39.37 | 39.37,39.37 JP13.4 | R7.2 27.94,38.1 v29.21,39.37 | v27.3,40.01 26.04,40.01 25.4,39.37 | 25.4,39.37 R8.2 | 25.99,34.97 24.13,36.83 | 24.13,36.83 24.13,38.1 | 24.13,38.1 25.4,39.37 | C9.1 24.13,34.29 | 24.13,34.29 24.13,36.83 | 24.13,34.29 R12.2 | C8.1 37.25,33.44 39.37,35.56 39.37,39.37 | 36.83,33.02 C8.1 | U2.6 36.2,31.96 C8.1 | U3.6 15.88,31.54 C5.1 13.97,33.02 v13.97,34.29 | R18.2 10.16,44.45 | 10.16,44.45 10.16,41.91 | R15.2 10.16,41.91 | 10.16,41.91 10.16,39.37 | R14.2 10.16,39.37 | 10.16,39.37 v12.7,37.47 | v20.95,47.31 C10.1 C11.1 | JP29.1 19.05,38.73 20.32,37.47 23.5,37.47 24.13,38.1
  Bottom 0.406: v17.78,67.31 v40.64,67.31 | 28.57,40.01 34.92,40.01 JP13.4 | 28.57,40.01 v29.21,39.37 27.3,37.47 v12.7,37.47 12.7,34.92 13.34,34.29 v13.97,34.29 | 28.57,40.01 v27.3,40.01 | v8.89,47.62 20.64,47.62 v20.95,47.31
  pour Top (isolate 0.406): -1.27,80.01 57.15,80.01 57.15,37.47 -1.27,37.47
VDD  (via drill 0.6)
  Top 0.406: v12.06,68.58 v15.88,68.58 | v40.01,68.58 v43.81,68.58 | R17.1 43.18,60.96 45.72,60.96 | R16.1 45.72,60.96 | 45.72,60.96 JP28.1
  Bottom 0.406: JP15.1 JP27.1 10.16,68.58 v12.06,68.58 | v15.88,68.58 v40.01,68.58 | v43.81,68.58 45.72,68.58 JP28.1 JP14.1

### Text on the board
tDocu: STEP | DIR | EN | GND | VCC | STEP | DIR | EN | GND | VCC | NC-GND | NC-VBB | NC-GND | NC-VBB | STEP | DIR | EN | GND | STEP | DIR | EN | VCC | VCC | GND | VDD | VDD | GND | GND | SDA | SDA | SCL | SCL | !DTR | VCC | GND | A | B | I2C_ADDRESS | TXD | RXD | VCC | Signal | GND | VCC | !RTS | GND | ADD | VCC | VREF | GND | SmoothieDriver DC-2 | dual dc motor controller | prototype 1 | http://www.smoothieware.org/ | designed by Logxen | for the RepRap community | produced by TrinityLabs | http://www.trinitylabs.com/ | VBB | GND | MOTOR1_B | MOTOR1_A | MOTOR0_B | MOTOR0_A | GND | GND | VBB | VBB